# EAGLE design Scematic_S (EAGLE 4.16)
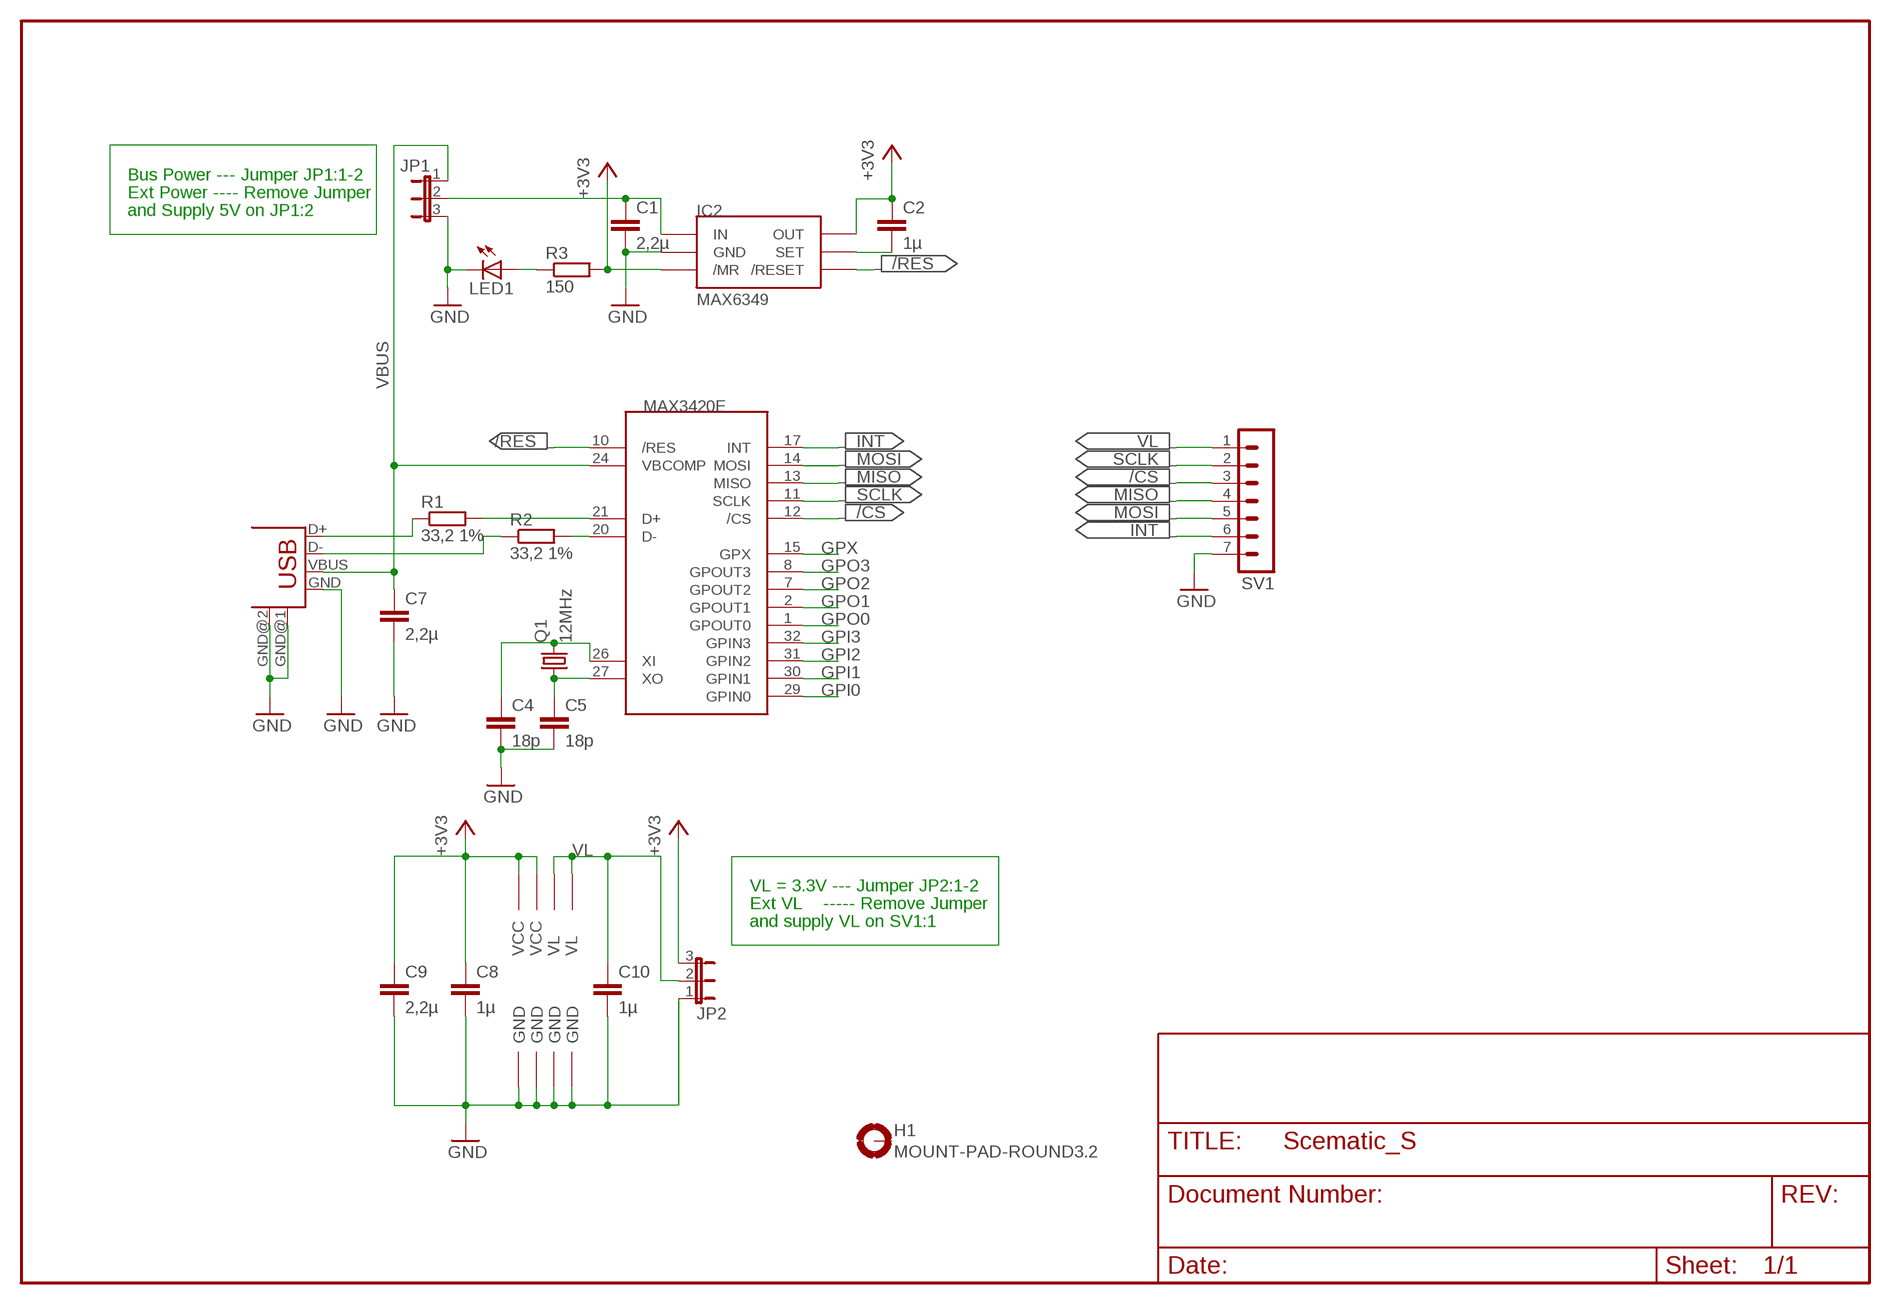
[diagram p0: schematic, sheet 1]

## Parts
C1  2,2µ  C-EUC0603  [C0603]
C2  1µ  C-EUC0603  [C0603]
C4  18p  C-EUC0402  [C0402]
C5  18p  C-EUC0402  [C0402]
C7  2,2µ  C-EUC0603  [C0603]
C8  1µ  C-EUC0603  [C0603]
C9  2,2µ  C-EUC0603  [C0603]
C10  1µ  C-EUC0603  [C0603]
H1  MOUNT-PAD-ROUND3.2  [3,2-PAD]
IC1  MAX3420E  [LQFP32]
IC2  MAX6349  [SOT23-6]
JP1  JP2E  [JP2]
JP2  JP2E  [JP2]
LED1  LEDCHIPLED_0805  [CHIPLED_0805]
Q1  12MHz  CRYTALHC49UP  [HC49UP]
R1  33,2 1%  R-EU_R0603  [R0603]
R2  33,2 1%  R-EU_R0603  [R0603]
R3  150  R-EU_R0603  [R0603]
SV1  MA07-1  [MA07-1]
USB1  USB-B-H  [USB-B-H]

## Nets
+3V3: C2.1 C8.1 C9.1 IC1.22(PWR:VCC$1) IC1.23(PWR:VCC$2) IC2.P$3(/MR) IC2.P$6(OUT) JP2.3 R3.2
/CS: IC1.12(/CS) SV1.3
/RES: IC1.10(/RES) IC2.P$4(/RESET)
GND: C1.2 C4.2 C5.2 C7.2 C8.2 C9.2 C10.2 IC1.5(PWR:GND$1) IC1.6(PWR:GND$2) IC1.18(PWR:GND$3) IC1.19(PWR:GND$4) IC2.P$2(GND) JP1.3 JP2.1 LED1.C SV1.7 USB1.GND USB1.GND@1(GND) USB1.GND@2(GND)
GPI0: IC1.29(GPIN0)
GPI1: IC1.30(GPIN1)
GPI2: IC1.31(GPIN2)
GPI3: IC1.32(GPIN3)
GPO0: IC1.1(GPOUT0)
GPO1: IC1.2(GPOUT1)
GPO2: IC1.7(GPOUT2)
GPO3: IC1.8(GPOUT3)
GPX: IC1.15(GPX)
INT: IC1.17(INT) SV1.6
MISO: IC1.13(MISO) SV1.4
MOSI: IC1.14(MOSI) SV1.5
N$1: C2.2 IC2.P$5(SET)
N$3: C1.1 IC2.P$1(IN) JP1.2
N$4: IC1.20(D-) R2.2
N$6: LED1.A R3.1
N$7: R2.1 USB1.D-
N$8: IC1.21(D+) R1.2
N$9: R1.1 USB1.D+
N$11: C5.1 IC1.27(XO) Q1.1
N$12: C4.1 IC1.26(XI) Q1.2
SCLK: IC1.11(SCLK) SV1.2
VBUS: C7.1 IC1.24(VBCOMP) JP1.1 USB1.VBUS
VL [power]: C10.1 IC1.3(PWR:VL$1) IC1.4(PWR:VL$2) JP2.2 SV1.1
Unconnected: H1.B3,2(MOUNT)

## Notes on the sheet
- Bus Power --- Jumper JP1:1-2
- Ext Power ---- Remove Jumper
- and Supply 5V on JP1:2
- VL = 3.3V --- Jumper JP2:1-2
- Ext VL    ----- Remove Jumper
- and supply VL on SV1:1

## Library data of the parts
C1 C2 C4 C5 C7-C10 = rcl:C-EU: CAPACITOR, European symbol
H1 = holes:MOUNT-PAD-ROUND: MOUNTING PAD, round
IC1 = MAXIM:MAX3420: MAX3420E USB Peripheral Controller with SPI Interface The MAX3420E contains the digital logic and analog circuitry necessary to implement a full-speed USB peripheral compliant to USB specification rev 2.0. A built-in full-speed transceiver features ±15kV ESD protection and programmable USB connect and disconnect. An internal serial-interface engine (SIE) handles low-level USB protocol details such as error checking and bus retries. The MAX3420E operates using a register set accessed by an SPI? interface that operates up to 26MHz. Any SPI master (microprocessor, ASIC, DSP, etc.) can add USB functionality using the simple 3- or 4-wire SPI interface.
IC2 = MAXIM:MAX6349
JP1 JP2 = jumper:JP2E: JUMPER
LED1 = led:LED: LED OSRAM: - CHIPLED LG R971, LG N971, LY N971, LG Q971, LY Q971, LO R971, LY R971 LH N974, LH R974 LS Q976, LO Q976, LY Q976 LO Q996 - Hyper CHIPLED LW Q18S LB Q993, LB Q99A, LB R99A - SideLED LS A670, LO A670, LY A670, LG A670, LP A670 LB A673, LV A673, LT A673, LW A673 LH A674 LY A675 LS A676, LA A676, LO A676, LY A676, LW A676 LS A679, LY A679, LG A679 - Hyper Micro SIDELED® LS Y876, LA Y876, LO Y876, LY Y876 LT Y87S - SmartLED LW L88C, LW L88S LB L89C, LB L89S, LG L890 LS L89K, LO L89K, LY L89K LS L896, LA L896, LO L896, LY L896 - TOPLED LS T670, LO T670, LY T670, LG T670, LP T670 LSG T670, LSP T670, LSY T670, LOP T670, LYG T670 LG T671, LOG T671, LSG T671 LB T673, LV T673, LT T673, LW T673 LH T674 LS T676, LA T676, LO T676, LY T676, LB T676, LH T676, LSB T676, LW T676 LB T67C, LV T67C, LT T67C, LS T67K, LO T67K, LY T67K, LW E67C LS E67B, LA E67B, LO E67B, LY E67B, LB E67C, LV E67C, LT E67C LW T67C LS T679, LY T679, LG T679 LS T770, LO T770, LY T770, LG T770, LP T770 LB T773, LV T773, LT T773, LW T773 LH T774 LS E675, LA E675, LY E675, LS T675 LS T776, LA T776, LO T776, LY T776, LB T776 LHGB T686 LT T68C, LB T68C - Hyper Mini TOPLED® LB M676 - Mini TOPLED Santana® LG M470 LS M47K, LO M47K, LY M47K Source: http://www.osram.convergy.de/
Q1 = crystal:CRYTAL: CRYSTAL
R1-R3 = rcl:R-EU_: RESISTOR, European symbol
SV1 = con-lstb:MA07-1: PIN HEADER
USB1 = con-usb-2:USB: USB Connectors

## Net classes
1 power: width 0.61 mm

## Board
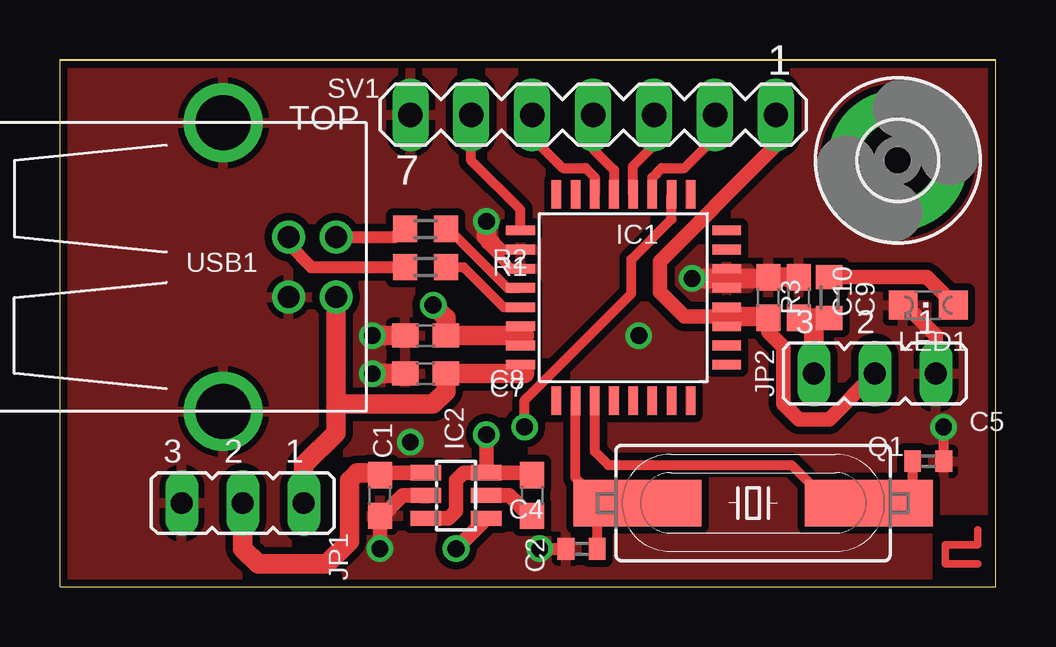
[diagram p1: board, top side]
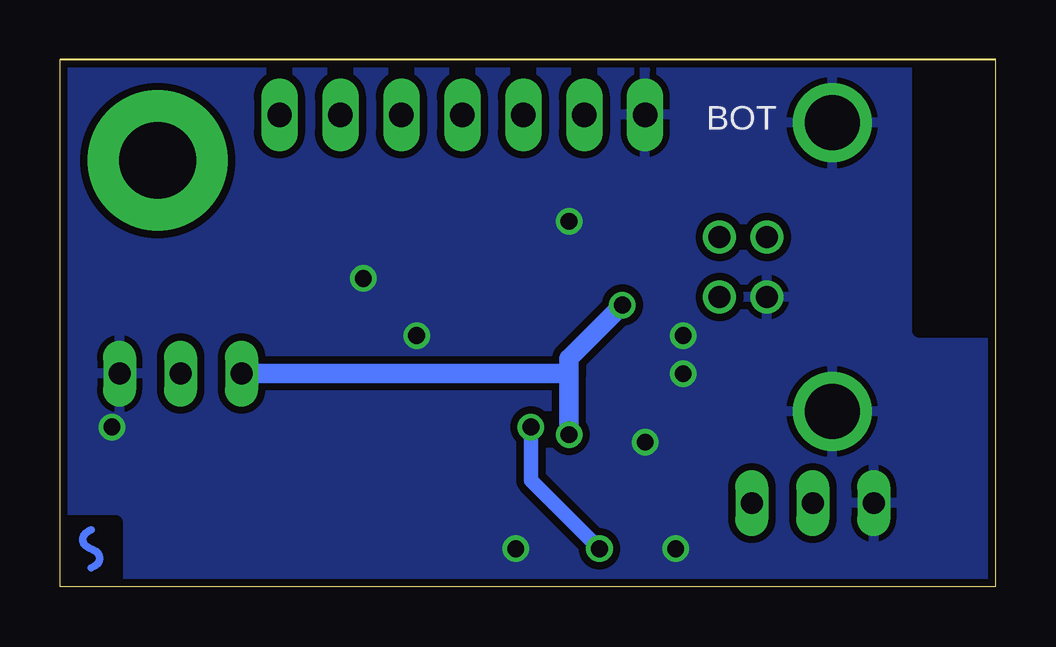
[diagram p2: board, bottom side, seen from below]

Size 39 x 21.96 mm. Coordinates in mm from the lower left corner, seen from the top.
Outline: 0,0 39,0 39,21.96 0,21.96 0,0
Copper layers (1*16): Top 0.035mm / dielectric 1.5mm / Bottom 0.035mm
Design rules "Fischer": minimum track width 10mil, minimum drill 0.6mm, track to track 0.15mm, track to pad 0.15mm, pad to pad 0.15mm, via to via 0.15mm, smd to smd 0.15mm, copper to edge 8mil, drill to drill 8mil, minimum pad ring 8mil, minimum via ring 8mil, stop-mask expansion 4mil, vias tented up to drill 0mil, thermal gap 10mil
tRestrict: area 36.7,0.5 to 38.7,2.7
bRestrict: area 2.7,11.2 to 2.8,11.5; area 2.7,12 to 2.8,13; area 2.7,11.2 to 2.7,11.5; area 2.7,12 to 2.7,13; area 2.6,11.2 to 2.7,11.5; area 2.6,12 to 2.7,13; area 2.6,11.2 to 2.6,11.5; area 2.6,12 to 2.6,13; area 2.6,11.2 to 2.6,11.5; area 2.6,12 to 2.6,13; area 2.5,11.2 to 2.6,11.5; area 2.5,12 to 2.6,13; 89 more areas
Milling: 4 lines

### Footprints (pad centres in the part's own frame; a part is rotated, then mirrored left to right if it is on the bottom)
C0603 = smd 1.1 x 1: 1 -0.85,0; 2 0.85,0
C0402 = smd 0.7 x 0.9: 1 -0.65,0; 2 0.65,0
3,2-PAD = drill 3.2 pad 5.842 round: B3,2 0,0
LQFP32 = smd 0.4 x 1.2: 1 -2.8,-4.3; 2 -2,-4.3; 3 -1.2,-4.3; 4 -0.4,-4.3; 5 0.4,-4.3; 6 1.2,-4.3; 7 2,-4.3; 8 2.8,-4.3; 17 2.8,4.3; 18 2,4.3; 19 1.2,4.3; 20 0.4,4.3; 21 -0.4,4.3; 22 -1.2,4.3; 23 -2,4.3; 24 -2.8,4.3 | smd 1.2 x 0.4: 9 4.3,-2.8; 10 4.3,-2; 11 4.3,-1.2; 12 4.3,-0.4; 13 4.3,0.4; 14 4.3,1.2; 15 4.3,2; 16 4.3,2.8; 25 -4.3,2.8; 26 -4.3,2; 27 -4.3,1.2; 28 -4.3,0.4; 29 -4.3,-0.4; 30 -4.3,-1.2; 31 -4.3,-2; 32 -4.3,-2.8
SOT23-6 = smd 0.635 x 1.27: P$1 -0.953,-1.27; P$2 0,-1.27; P$3 0.953,-1.27; P$4 0.953,1.27; P$5 0,1.27; P$6 -0.953,1.27
JP2 = drill 0.914 long: 1 -2.54,0; 2 0,0; 3 2.54,0
CHIPLED_0805 = smd 1.2 x 1.2: A 0,-1.05; C 0,1.05
HC49UP = smd 5.334 x 1.93: 1 -4.826,0; 2 4.826,0
R0603 = smd 1 x 1.1: 1 -0.85,0; 2 0.85,0
MA07-1 = drill 1.016 long: 1 -7.62,0; 2 -5.08,0; 3 -2.54,0; 4 0,0; 5 2.54,0; 6 5.08,0; 7 7.62,0
USB-B-H = drill 0.914 round: D+ 0,1.25; D- 1.981,1.25; GND 0,-1.25; VBUS 1.981,-1.25 | drill 2.286 round: GND@1 -2.718,6.02; GND@2 -2.718,-6.02

### Placement (x,y rotation side)
C1  13.34,3.81 270 top
C2  19.68,3.81 270 top
C4  21.75,1.59 180 top
C5  36.19,5.24 0 top
C7  15.24,8.89 180 top
C8  15.24,10.48 180 top
C9  30.8,12.06 90 top
C10  29.53,12.06 90 top
H1  34.92,17.78 0 top
IC1  23.5,12.06 90 top
IC2  16.51,3.81 270 top
JP1  7.62,3.49 180 top
JP2  33.97,8.89 180 top
LED1  36.2,11.75 90 top
Q1  28.89,3.49 180 top
R1  15.24,13.34 0 top
R2  15.24,14.92 0 top
R3  32.07,12.06 270 top
SV1  22.23,19.68 180 top
USB1  9.53,13.34 0 top

### Tracks (layer width: path | path; a pad name or v marks a point on that pad's centre or on a via)
+3V3  (via drill 0.7)
  Top 0.406: IC1.23 19.2,10.3 19.37,10.48 19.2,10.65 IC1.22
  Top 0.61: C2.1 19.68,4.76 IC2.P$6 | IC2.P$3 16.19,2.86 16.51,3.17 16.51,4.45 16.83,4.76 IC2.P$6 | IC2.P$6 v17.78,6.35
  Top 0.813: C9.1 30.8,11.27 30.85,11.21 31.43,11.21 | 31.43,11.21 R3.2 | C8.1 16.09,11.21 v15.56,11.75 | C8.1 16.03,10.48 | C8.1 19.37,10.48 | JP2.3 31.43,11.21
  Bottom 0.813: v17.78,6.35 17.78,8.89 | 17.78,8.89 17.78,9.53 v15.56,11.75 | 17.78,8.89 JP2.3
/CS
  Top 0.406: IC1.12 23.89,17.55 24.77,18.41 SV1.3
/RES  (via drill 0.7)
  Top 0.406: IC1.10 25.5,15.34 23.81,13.65 23.81,12.22 20.64,9.05 19.45,7.86 19.37,7.78 v19.37,6.67
  Top 0.61: v16.51,1.59 IC2.P$4
  Bottom 0.61: v16.51,1.59 19.37,4.45 v19.37,6.67
GND  (via drill 0.7)
  Top 0.406: IC1.19 18.8,13.27 17.78,14.29 17.78,14.61 | IC1.5 27.8,12.69 27.62,12.86 27.8,13.03 IC1.6 | IC1.18 18.48,14.06 17.78,14.76 | C5.2 36.84,6.65 v36.83,6.67
  Top 0.508: v20,1.59 C4.2
  Top 0.61: IC2.P$2 14.29,3.81 13.34,2.86 C1.2 v13.34,1.59 | LED1.C 35.24,11.75 36.51,10.48 JP2.1
  Top 0.813: 17.78,14.61 17.78,14.76 v17.78,15.24 | C9.2 30.8,12.86 30.74,12.91 C10.2 29.53,12.86 27.62,12.86 v26.35,12.86 | C8.2 v13.02,10.48 | C7.2 v13.02,8.89
  other vias: 14.61,6.03 24.13,10.48
  pour Bottom (isolate 0.305): 0,22.59 39.37,22.59 39.37,0 0,0
  pour Top (isolate 0.305): 0,22.59 39.37,22.59 39.37,0 0,0
INT
  Top 0.406: IC1.17 19.2,15.73 17.14,17.78 SV1.6
MISO
  Top 0.406: IC1.13 23.09,17.39 22.23,18.26 SV1.4
MOSI
  Top 0.406: IC1.14 22.3,17.07 21.91,17.46 20.95,17.46 19.68,18.73 SV1.5
N$1
  Top 0.61: C2.2 19.58,2.96 18.73,3.81 IC2.P$5
N$3
  Top 0.61: 13.34,4.76 IC2.P$1
  Top 0.813: JP1.2 7.62,1.59 8.26,0.95 11.11,0.95 12.06,1.91 12.06,4.45 12.38,4.76 13.34,4.76 C1.1
N$4
  Top 0.406: R2.2 16.19,14.92 18.65,12.46 IC1.20
N$6
  Top 0.61: LED1.A 37.24,11.81 36.14,12.91 R3.1
N$7
  Top 0.508: R2.1 14.29,14.92 13.95,14.59 USB1.D-
N$8
  Top 0.406: IC1.21 18.5,11.66 16.83,13.34 R1.2
N$9
  Top 0.508: USB1.D+ 9.53,14.29 10.48,13.34 R1.1
N$10
  Top 0.305: 38.26,0.95 36.91,0.95 36.91,1.75 38.26,1.75 38.26,2.38
N$11
  Top 0.406: IC1.27 22.3,5.64 22.86,5.08 30.48,5.08 32.07,3.49 33.66,3.49 | C5.1 35.55,3.79 35.24,3.49 33.66,3.49 | 33.66,3.49 | 33.66,3.49 Q1.1
N$12
  Top 0.406: IC1.26 21.5,4.54 22.54,3.49 22.86,3.49 | 24.13,3.49 | 24.13,3.49 Q1.2 | 22.86,3.49 24.13,3.49 | C4.1 22.4,3.03 22.86,3.49
N$13
  Bottom 0.305: 37.7,0.79 37.54,0.87 arc-127 37.54,1.51 arc0 37.86,1.67 arc111 37.94,2.22 arc18 37.7,2.38
SCLK
  Top 0.406: IC1.11 24.7,17.07 25.08,17.46 26.04,17.46 27.3,18.73 SV1.2
VBUS
  Top 0.406: IC1.24 19.2,9.06 19.37,8.89
  Top 0.813: 19.37,8.89 C7.1 16.09,8.15 15.56,7.62 11.51,7.62 | 11.51,7.62 11.51,6.43 10.16,5.08 JP1.1 | 11.51,7.62 USB1.VBUS
VL
  Top 0.406: 27.8,11.44 | 27.8,11.44 27.78,11.43 | IC1.3 27.8,11.1 27.62,11.27 27.8,11.44 | 27.8,11.44 IC1.4
  Top 0.61: C10.1 29.53,10.64 30.16,10 30.16,7.62 30.8,6.99 32.07,6.99 JP2.2 | 27.62,11.27 26.04,11.27 25,12.3 25,13.57 29.53,18.1 29.84,18.41 SV1.1
  Top 0.813: C10.1 29.53,11.27 27.62,11.27

### Text on the board
tPlace: TOP
bPlace: BOT
bStop: INOSENS
bRestrict: INOSENS
Measures: 39 mm | 24 mm | 4,5 mm | 4,5 mm
Kamera: 20 17 | 1 15 | 21 15 | 19 20 | 18 25 | 2 40 | 17 25 | 3 45 | 16 20 | 4 50 | 15 17 | v1 0 | v10 0 | v11 0 | v12 0 | v13 0 | v14 0 | v15 0 | v16 0 | v17 0 | v18 0 | v19 0 | v2 0 | v20 0 | v21 0 | v3 0 | v4 0 | v5 0 | v6 0 | v7 0 | v8 0 | v9 0 | 5 50 | 14 15 | 6 45 | 13 10 | 7 40 | 12 15 | 8 25 | 9 20 | 11 15 | 10 20